# Altium project PANEL.PrjPcb
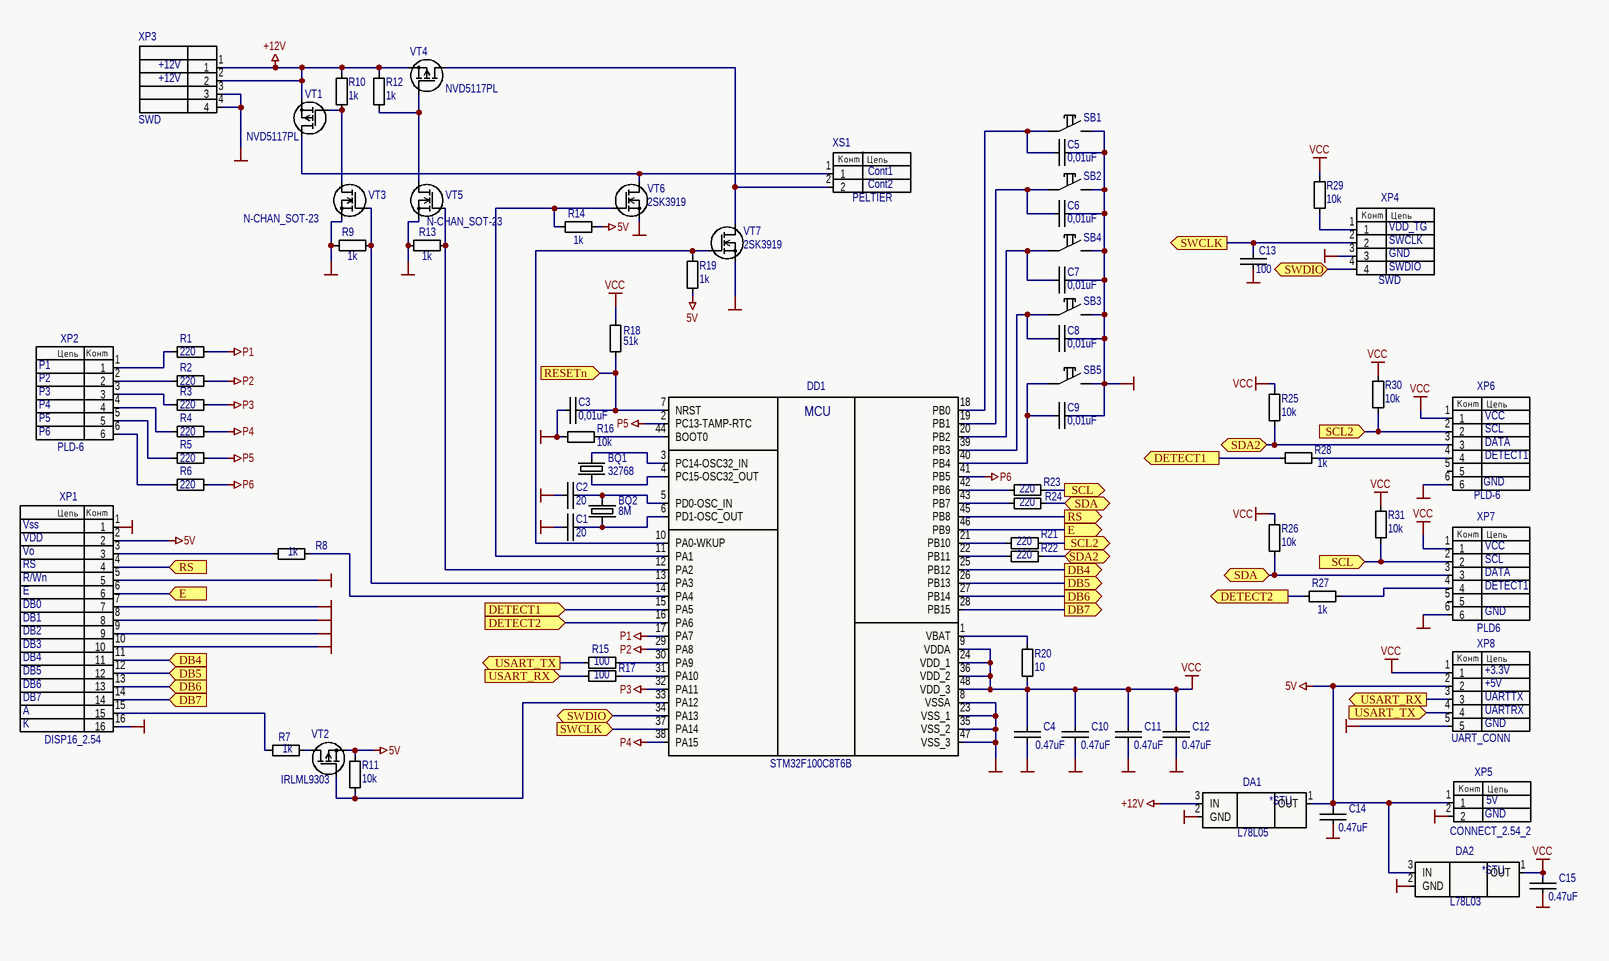
[diagram p0: PANEL.SchDoc]
1 sheet, 72 parts. Net scope: flat (ports and power ports of the same name join across sheets).
Board file: PANEL.PcbDoc

## Sheet PANEL.SchDoc
size 420 x 297 mm; Scale: {Масш.}; Title1str: {Наименование}; PageSetup: Record=PageOptions|CenterHorizontal=False|CenterVertical=False|PrintScale=0.67|XCorrection=0.00|YCorrection=0.00|PrintKind=1|BorderSize=5000000|LeftOffset=0|BottomOffset=0|Orientation=2|PaperLength=1000|PaperWidth=1000|Scale=100|PaperSource=7|PrintQuality=600|MediaType=1|DitherType=10|PaperKind=A4|PrintScaleMode=1; Title2str: {Наименование}; ProcessInspection: {Т.контр.}; Mass: {Масса}; NormInspection: {Н.контр.}; EngineerName: {Инженер}; Letter1Column: {}; Letter2Column: {}; Letter3Column: {}; DocumentType: ?????????????? ?????; DocumentType1str: {Документ}; DocumentType2str: {Документ}

### Parts
BQ1  32768  [WatchQ]
BQ2  8M  [HC 49S]
C1  20  [Cap_0805]
C2  20  [Cap_0805]
C3  0,01uF  [Cap_0805]
C4  0.47uF  [Cap_0805]
C5  0,01uF  [Cap_0805]
C6  0,01uF  [Cap_0805]
C7  0,01uF  [Cap_0805]
C8  0,01uF  [Cap_0805]
C9  0,01uF  [Cap_0805]
C10  0.47uF  [Cap_0805]
C11  0.47uF  [Cap_0805]
C12  0.47uF  [Cap_0805]
C13  100  [Cap_0805]
C14  0.47uF  [Cap_0805]
C15  0.47uF  [Cap_0805]
DA1  L78L05  [kren]
DA2  L78L03  [kren]
DD1  STM32F100C8T6B  [LQFP48]
R1  220  [Res_0805]
R2  220  [Res_0805]
R3  220  [Res_0805]
R4  220  [Res_0805]
R5  220  [Res_0805]
R6  220  [Res_0805]
R7  1k  [Res_0805]
R8  1k  [Res_0805]
R9  1k  [Res_0805]
R10  1k  [Res_0805]
R11  10k  [Res_0805]
R12  1k  [Res_0805]
R13  1k  [Res_0805]
R14  1k  [Res_0805]
R15  100  [Res_0805]
R16  10k  [Res_0805]
R17  100  [Res_0805]
R18  51k  [Res_0805]
R19  1k  [Res_0805]
R20  10  [Res_0805]
R21  220  [Res_0805]
R22  220  [Res_0805]
R23  220  [Res_0805]
R24  220  [Res_0805]
R25  10k  [Res_0805]
R26  10k  [Res_0805]
R27  1k  [Res_0805]
R28  1k  [Res_0805]
R29  10k  [Res_0805]
R30  10k  [Res_0805]
R31  10k  [Res_0805]
SB1  TS A3PV 130  [TS A3PV 130]  (value not drawn)
SB2  TS A3PV 130  [TS A3PV 130]  (value not drawn)
SB3  TS A3PV 130  [TS A3PV 130]  (value not drawn)
SB4  TS A3PV 130  [TS A3PV 130]  (value not drawn)
SB5  TS A3PV 130  [TS A3PV 130]  (value not drawn)
VT1  NVD5117PL  [TO-252]
VT2  IRLML9303  [SOT-23]
VT3  N-CHAN_SOT-23  [SOT-23]
VT4  NVD5117PL  [TO-252]
VT5  N-CHAN_SOT-23  [SOT-23]
VT6  2SK3919  [TO-252]
VT7  2SK3919  [TO-252]
XP1  DISP16_2.54  [DISP16_2.54]
XP2  PLD-6  [CONN_2.54_6_2]
XP3  SWD  [CONN_2.54_4]
XP4  SWD  [CONN_2.54_4]
XP5  CONNECT_2.54_2  [CONN_2.54_2]
XP6  PLD-6  [CONN_2.54_6_2]
XP7  PLD6  [CONN_2.54_6_2]
XP8  UART_CONN  [CONN_2.54_5]
XS1  PELTIER  [PELTIER]

### Ports
DB4 (in), DB4 (out), DB5 (in), DB5 (out), DB6 (in), DB6 (out), DB7 (in), DB7 (out), DETECT1 (in), DETECT1 (out), DETECT2 (in), DETECT2 (out), E (in), E (out), RESETn (in), RS (in), RS (out), SCL2 (in), SCL2 (out), SCL (in), SCL (out), SDA2 (bidir), SDA (bidir), SWCLK (in), SWCLK (out), SWDIO (bidir), USART_RX (in), USART_RX (out), USART_TX (in), USART_TX (out)

### Nets
5V: C14.2 DA1.1(OUT) DA2.3(IN) R11.1 R14.2 R19.1 VT2.2 XP1.2 XP5.1 XP8.2
+12V: DA1.3(IN) R10.1 R12.2 VT1.3 VT4.3 XP3.1 XP3.2
GND: C1.1 C2.1 C3.1 C4.1 C5.2 C6.2 C7.2 C8.2 C9.2 C10.1 C11.1 C12.1 C13.1 C14.1 C15.1 DA1.2(GND) DA2.2(GND) DD1.8(VSSA) DD1.23(VSS_1) DD1.35(VSS_2) DD1.47(VSS_3) R9.2 R13.1 R16.2 SB1.2(IN) SB2.2(IN) SB3.2(IN) SB4.2(IN) SB5.2(IN) VT3.2 VT5.2 VT6.3 VT7.3 XP1.1 XP1.5 XP1.7 XP1.8 XP1.9 XP1.10 XP1.16 XP3.3 XP3.4 XP4.3 XP5.2 XP6.6 XP7.6 XP8.5
P1: DD1.17(PA7) R1.2
P2: DD1.29(PA8) R2.2
P3: DD1.32(PA11) R3.2
P4: DD1.38(PA15) R4.1
P5: DD1.2(PC13-TAMP-RTC) R5.1
P6: DD1.41(PB5) R6.2
VCC: C4.2 C10.2 C11.2 C12.2 C15.2 DA2.1(OUT) DD1.9(VDDA) DD1.24(VDD_1) DD1.36(VDD_2) DD1.48(VDD_3) R18.2 R20.2 R25.2 R26.2 R29.2 R30.2 R31.2 XP6.1 XP7.1 XP8.1
NetBQ1_1: BQ1.1 DD1.3(PC14-OSC32_IN)
NetBQ1_2: BQ1.2 DD1.4(PC15-OSC32_OUT)
NetBQ2_1: BQ2.1 C1.2 DD1.6(PD1-OSC_OUT)
NetBQ2_2: BQ2.2 C2.2 DD1.5(PD0-OSC_IN)
NetC3_2: C3.2 DD1.7(NRST) R18.1 ; port RESETn
NetC5_1: C5.1 DD1.18(PB0) SB1.1(OUT)
NetC6_1: C6.1 DD1.19(PB1) SB2.1(OUT)
NetC7_1: C7.1 DD1.20(PB2) SB4.1(OUT)
NetC8_1: C8.1 DD1.39(PB3) SB3.1(OUT)
NetC9_1: C9.1 DD1.40(PB4) SB5.1(OUT)
NetC13_2: C13.2 DD1.37(PA14) XP4.2 ; port SWCLK
NetDD1_1: DD1.1(VBAT) R20.1
NetDD1_10: DD1.10(PA0-WKUP) R19.2 VT7.1
NetDD1_11: DD1.11(PA1) R14.1 VT6.1
NetDD1_12: DD1.12(PA2) R13.2 VT5.1
NetDD1_13: DD1.13(PA3) R9.1 VT3.1
NetDD1_14: DD1.14(PA4) R8.1
NetDD1_15: DD1.15(PA5) R28.2 ; port DETECT1
NetDD1_16: DD1.16(PA6) R27.2 ; port DETECT2
NetDD1_21: DD1.21(PB10) R21.2
NetDD1_22: DD1.22(PB11) R22.2
NetDD1_25: DD1.25(PB12) XP1.11 ; port DB4
NetDD1_26: DD1.26(PB13) XP1.12 ; port DB5
NetDD1_27: DD1.27(PB14) XP1.13 ; port DB6
NetDD1_28: DD1.28(PB15) XP1.14 ; port DB7
NetDD1_30: DD1.30(PA9) R15.2
NetDD1_31: DD1.31(PA10) R17.2
NetDD1_33: DD1.33(PA12) R11.2 VT2.1
NetDD1_34: DD1.34(PA13) XP4.4 ; port SWDIO
NetDD1_42: DD1.42(PB6) R23.2
NetDD1_43: DD1.43(PB7) R24.2
NetDD1_44: DD1.44(BOOT0) R16.1
NetDD1_45: DD1.45(PB8) XP1.4 ; port RS
NetDD1_46: DD1.46(PB9) XP1.6 ; port E
NetR1_1: R1.1 XP2.1
NetR2_1: R2.1 XP2.2
NetR3_1: R3.1 XP2.3
NetR4_2: R4.2 XP2.4
NetR5_2: R5.2 XP2.5
NetR6_1: R6.1 XP2.6
NetR7_1: R7.1 VT2.3
NetR7_2: R7.2 XP1.15
NetR8_2: R8.2 XP1.3
NetR10_2: R10.2 VT1.1 VT3.3
NetR12_1: R12.1 VT4.1 VT5.3
NetR15_1: R15.1 XP8.4 ; port USART_TX
NetR17_1: R17.1 XP8.3 ; port USART_RX
NetR21_1: R21.1 R30.1 XP6.2 ; port SCL2
NetR22_1: R22.1 R25.1 XP6.3 ; port SDA2
NetR23_1: R23.1 R31.1 XP7.2 ; port SCL
NetR24_1: R24.1 R26.1 XP7.3 ; port SDA
NetR27_1: R27.1 XP7.4
NetR28_1: R28.1 XP6.4
NetR29_1: R29.1 XP4.1
NetVT1_2: VT1.2 VT6.2 XS1.1
NetVT4_2: VT4.2 VT7.2 XS1.2

Not connected (* = marked no-connect by the designer): XP6 5; XP7 5

### Notes on the sheet
- (near XP3) +12V
- (near XS1) Cont1
- (near XS1) Cont2
- (near XP4) SWCLK
- (near XP4) VDD_TG
- (near XP4) SWDIO
- (near XP4) GND
- P1
- P2
- P3
- P4
- P5
- P6
- (near XP6) VCC
- (near XP6) DATA
- (near XP6) SCL
- (near XP6) GND
- (near XP6) DETECT1
- Vss
- VDD
- Vo
- RS
- R/Wn
- (near XP7) VCC
- (near XP7) DATA
- (near XP7) SCL
- E
- DB0
- DB1
- DB2
- DB3
- (near XP7) DETECT1
- (near XP7) GND
- DB4
- DB5
- DB6
- DB7
- A
- (near XP8) UARTRX
- (near XP8) UARTTX
- (near XP8) +5V
- (near XP8) +3.3V
- K
- (near XP8) GND
- (near XP5) GND
- (near XP5) 5V
- (in symbol kren) *STU
- (in symbol STM32F100C8T6B) MCU

### Library data of the parts
BQ1 = WatchQ
BQ2 = BQ_HC 49S: PackageReference: HC-49S
C1 C2 = Cap_0805: Manufacturer: AVX; Part Number: 08051A200JAT2A; Replacement: GCM2165C1H200JD01J; PackageReference: 0805; Value: 20; Distributor: http://www.chipel.ru/; Price: 0.18
C3 C5-C9 = Cap_0805: Manufacturer: AVX; Part Number: 08055C103JAT2A; Replacement: GRM2195C1H103JA01D; Value: 0.01uF; PackageReference: 0805; Distributor: http://www.chipel.ru/; Price: 0.30
C4 C10-C12 C14 C15 = Cap_0805: Manufacturer: AVX; Part Number: 0805YC475KAT2A; Replacement: GRM21BR61E475KA12L; Value: 1uF; PackageReference: 0805; Distributor: http://www.kontest.ru; Price: 9.53
C13 = Cap_0805: Manufacturer: AVX; Part Number: 08055C101KAT2A; Replacement: GRM2165C2A101JA01D; ASSY_OPT: ASSY_OPT; PackageReference: PackageReference; Value: 100; Distributor: http://www.chipel.ru/; Price: 8.00
DA1 = kren: Part Number: L78L05
DA2 = kren: Part Number: L78L05
R1-R3 R6 R9 R12 R13 R15 R17 = Res_0805
  R9 R13: Value: 1k
  R12: PackageReference: 0805 1k
  R15 R17: PackageReference: 0805; Value: 100
R4 R5 R27 R28 = Res_0805: Manufacturer: Vishay; Part Number: CRCW080510K0JNTA; Replacement: 0.30; Value: 10k; PackageReference: 0805; Distributor: http://www.kontest.ru; Price: Price
R7 R8 R21-R24 = Res_0805: Value: 100; PackageReference: 0805
R10 = Res_0805: Manufacturer: Vishay; Replacement: RC0805JR 0710KL; Value: 10k; PackageReference: 0805; Part Number: SMD 0805; Distributor: http://www.kontest.ru; Price: 0.30
R11 R16 = Res_0805: Manufacturer: Vishay; Part Number: CRCW080510K0JNTA; Replacement: RC0805JR 0710KL; PackageReference: 0805; Value: 10k; Distributor: http://www.kontest.ru; Price: 0.30
R14 R19 = Res_0805: Part Number: 0805 1k
R18 = Res_0805: Manufacturer: Vishay; Part Number: CRCW08055K00JNTA; Replacement: RC0805JR-0751KL; PackageReference: 0805; Value: 51k; Distributor: http://www.abtronics.ru; Price: 1.50
R20 = Res_0805: Manufacturer: Vishay; Part Number: CRCW080510R0FKEA; Replacement: RC0805JR-0710RL; PackageReference: 0805; Value: 10; Distributor: http://www.platan.ru; Price: 0.24
R25 R26 R29-R31 = Res_0805: Manufacturer: Vishay; Part Number: CRCW080510K0JNTA; Replacement: 0.30; PackageReference: 0805; Value: 10k; Distributor: http://www.kontest.ru; Price: Price
SB1-SB5 = TS A3PV 130: Button
VT1 VT4 = P-CHAN_TO-252: Part Number: NVD5117PL
VT2 = P-CHAN_SOT-23: Part Number: IRLML9303TRPBF; Distributor: http://platan.ru/
VT6 VT7 = N-CHAN_TO-252: Part Number: 2SK3919
XP2 XP6 XP7 = CONNECT_2.54_6_2
XP3 XP4 = CONNECT_SWD: ASSY_OPT: ASSY_OPT; Manufacturer: Manufacturer; PackageReference: PackageReference; Replacement: Replacement; Part Number: Part Number; Value: Value; Distributor: Distributor; Price: Price
XP8 = CONNECT_2.54_5
DD1 = STM32F100C8T6B: ASSY_OPT: ASSY_OPT; Manufacturer: Manufacturer; PackageReference: PackageReference; Replacement: Replacement; Part Number: Part Number; Value: Value; Distributor: Distributor; Price: Price